# EAGLE design LED_Platine_4x4 (EAGLE 5.04)
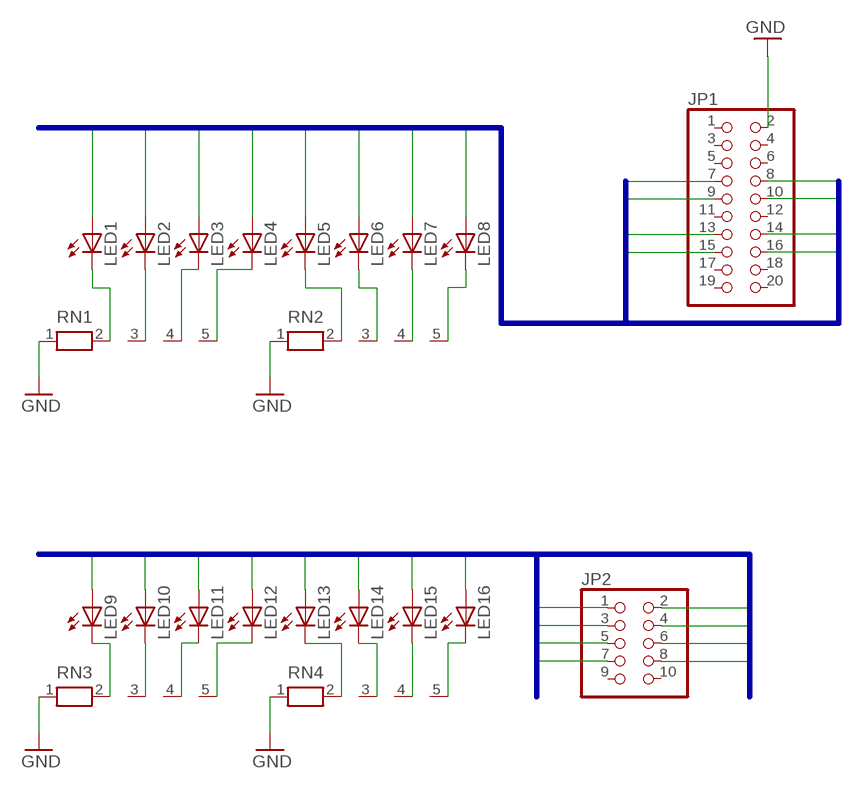
[diagram p0: schematic, sheet 1]

## Parts
JP1  PINHD-2X10  [2X10]
JP2  PINHD-2X5  [2X05]
LED1  LED3MM  [LED3MM]
LED2  LED3MM  [LED3MM]
LED3  LED3MM  [LED3MM]
LED4  LED3MM  [LED3MM]
LED5  LED3MM  [LED3MM]
LED6  LED3MM  [LED3MM]
LED7  LED3MM  [LED3MM]
LED8  LED3MM  [LED3MM]
LED9  LED3MM  [LED3MM]
LED10  LED3MM  [LED3MM]
LED11  LED3MM  [LED3MM]
LED12  LED3MM  [LED3MM]
LED13  LED3MM  [LED3MM]
LED14  LED3MM  [LED3MM]
LED15  LED3MM  [LED3MM]
LED16  LED3MM  [LED3MM]
RN1  RN04  [RN-5]
RN2  RN04  [RN-5]
RN3  RN04  [RN-5]
RN4  RN04  [RN-5]

## Nets
GND: JP1.2 RN1.1 RN2.1 RN3.1 RN4.1
IO9: JP2.1 LED9.A
IO10: JP2.2 LED10.A
IO11: JP2.3 LED11.A
IO12: JP2.4 LED12.A
IO13: JP2.5 LED13.A
IO14: JP2.6 LED14.A
IO15: JP2.7 LED15.A
IO16: JP2.8 LED16.A
N$1: LED1.K(C) RN1.2
N$2: LED2.K(C) RN1.3
N$3: LED3.K(C) RN1.4
N$4: LED4.K(C) RN1.5
N$6: LED9.K(C) RN3.2
N$7: LED10.K(C) RN3.3
N$8: LED11.K(C) RN3.4
N$10: LED12.K(C) RN3.5
N$13: LED13.K(C) RN4.2
N$14: LED5.K(C) RN2.2
N$15: LED14.K(C) RN4.3
N$16: LED6.K(C) RN2.3
N$17: LED7.K(C) RN2.4
N$18: LED8.K(C) RN2.5
N$19: LED15.K(C) RN4.4
N$20: LED16.K(C) RN4.5
P0.0: JP1.7 LED1.A
P0.1: JP1.8 LED2.A
P0.2: JP1.9 LED3.A
P0.3: JP1.10 LED4.A
P0.4: JP1.13 LED5.A
P0.5: JP1.14 LED6.A
P0.6: JP1.15 LED7.A
P0.7: JP1.16 LED8.A
Unconnected: JP1.1 JP1.3 JP1.4 JP1.5 JP1.6 JP1.11 JP1.12 JP1.17 JP1.18 JP1.19 JP1.20 JP2.9 JP2.10

## Buses
P0.[0..7]
IO[9..16]

## Library data of the parts
JP1 = pinhead:PINHD-2X10: PIN HEADER
JP2 = pinhead:PINHD-2X5: PIN HEADER
LED1-LED16 = led:LED: LED OSRAM: - CHIPLED LG R971, LG N971, LY N971, LG Q971, LY Q971, LO R971, LY R971 LH N974, LH R974 LS Q976, LO Q976, LY Q976 LO Q996 - Hyper CHIPLED LW Q18S LB Q993, LB Q99A, LB R99A - SideLED LS A670, LO A670, LY A670, LG A670, LP A670 LB A673, LV A673, LT A673, LW A673 LH A674 LY A675 LS A676, LA A676, LO A676, LY A676, LW A676 LS A679, LY A679, LG A679 - Hyper Micro SIDELED® LS Y876, LA Y876, LO Y876, LY Y876 LT Y87S - SmartLED LW L88C, LW L88S LB L89C, LB L89S, LG L890 LS L89K, LO L89K, LY L89K LS L896, LA L896, LO L896, LY L896 - TOPLED LS T670, LO T670, LY T670, LG T670, LP T670 LSG T670, LSP T670, LSY T670, LOP T670, LYG T670 LG T671, LOG T671, LSG T671 LB T673, LV T673, LT T673, LW T673 LH T674 LS T676, LA T676, LO T676, LY T676, LB T676, LH T676, LSB T676, LW T676 LB T67C, LV T67C, LT T67C, LS T67K, LO T67K, LY T67K, LW E67C LS E67B, LA E67B, LO E67B, LY E67B, LB E67C, LV E67C, LT E67C LW T67C LS T679, LY T679, LG T679 LS T770, LO T770, LY T770, LG T770, LP T770 LB T773, LV T773, LT T773, LW T773 LH T774 LS E675, LA E675, LY E675, LS T675 LS T776, LA T776, LO T776, LY T776, LB T776 LHGB T686 LT T68C, LB T68C - Hyper Mini TOPLED® LB M676 - Mini TOPLED Santana® LG M470 LS M47K, LO M47K, LY M47K Source: http://www.osram.convergy.de - LUMILED® LXK2-PW12-R00, LXK2-PW12-S00, LXK2-PW14-U00, LXK2-PW14-V00 LXK2-PM12-R00, LXK2-PM12-S00, LXK2-PM14-U00 LXK2-PE12-Q00, LXK2-PE12-R00, LXK2-PE12-S00, LXK2-PE14-T00, LXK2-PE14-U00 LXK2-PB12-K00, LXK2-PB12-L00, LXK2-PB12-M00, LXK2-PB14-N00, LXK2-PB14-P00, LXK2-PB14-Q00 LXK2-PR12-L00, LXK2-PR12-M00, LXK2-PR14-Q00, LXK2-PR14-R00 LXK2-PD12-Q00, LXK2-PD12-R00, LXK2-PD12-S00 LXK2-PH12-R00, LXK2-PH12-S00 LXK2-PL12-P00, LXK2-PL12-Q00, LXK2-PL12-R00 Source: www.luxeon.com
RN1-RN4 = resistor-net:RN04: RESISTOR NETWORK

## Board
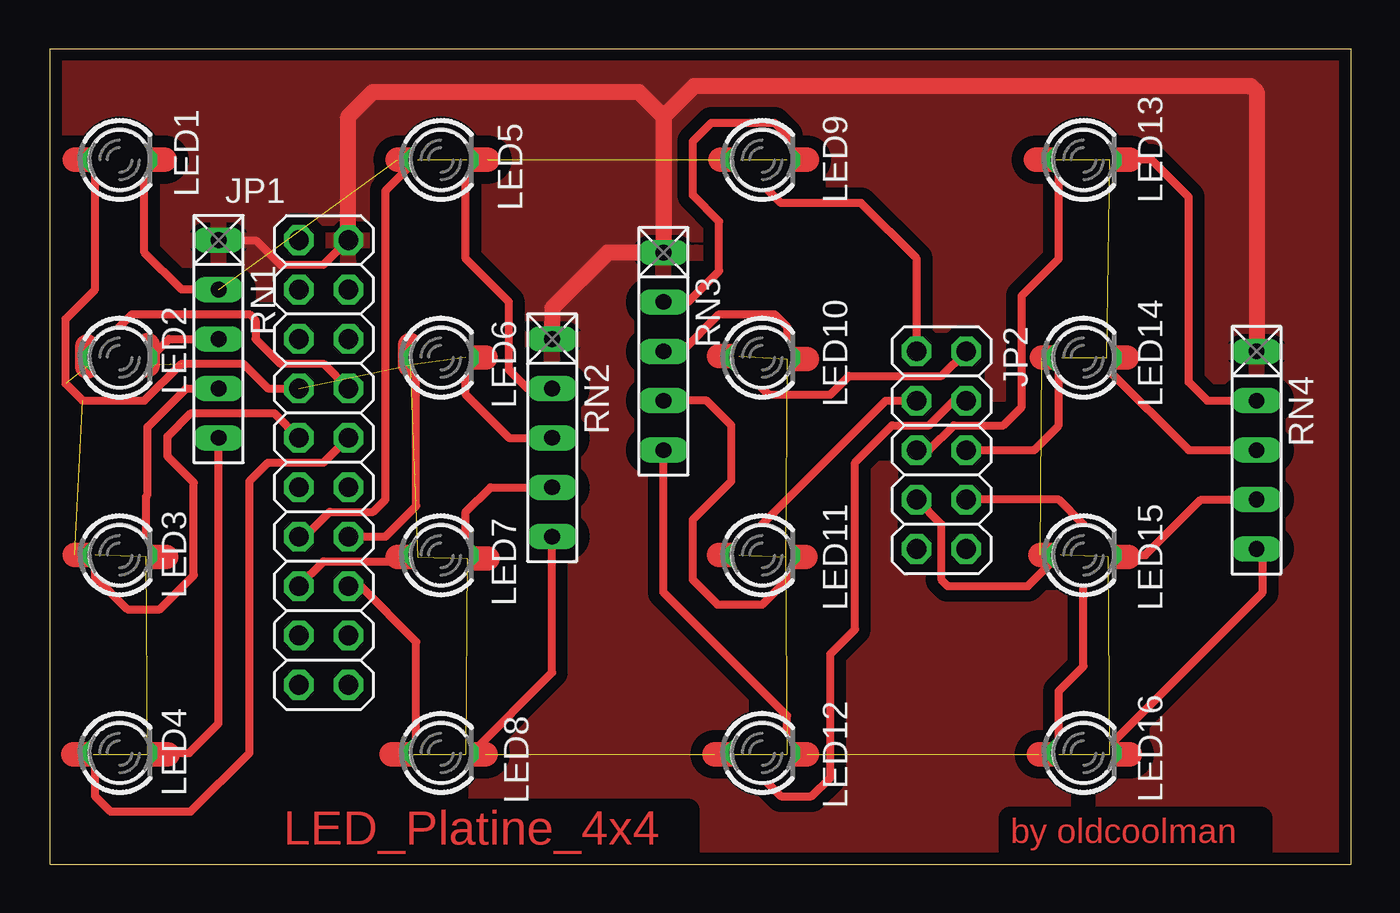
[diagram p1: board, top side]

Size 66.84 x 41.91 mm. Coordinates in mm from the lower left corner, seen from the top.
Outline: 0,0 0,41.91 66.84,41.91 66.84,0 0,0
Copper layers (1*16): Top 0.035mm / dielectric 1.5mm / Bottom 0.035mm
Design rules "default": minimum track width 10mil, minimum drill 24mil, track to track 12mil, track to pad 12mil, pad to pad 12mil, via to via 12mil, smd to smd 8mil, copper to edge 20mil, drill to drill 8mil, minimum pad ring 10mil, minimum via ring 8mil, stop-mask expansion 4mil, vias tented up to drill 0mil, thermal gap 10mil
Holes 3.2 mm at 3.58,36.2 3.58,26.03 3.58,15.87 3.58,5.71 20.09,36.2 20.09,26.03 20.09,15.87 20.09,5.71 36.59,36.2 36.59,26.03 36.59,15.87 36.59,5.71 53.1,36.2 53.1,26.03 53.1,15.87 53.1,5.71

### Footprints (pad centres in the part's own frame; a part is rotated, then mirrored left to right if it is on the bottom)
2X10 = drill 1.016 octagon: 1 -11.43,-1.27; 2 -11.43,1.27; 3 -8.89,-1.27; 4 -8.89,1.27; 5 -6.35,-1.27; 6 -6.35,1.27; 7 -3.81,-1.27; 8 -3.81,1.27; 9 -1.27,-1.27; 10 -1.27,1.27; 11 1.27,-1.27; 12 1.27,1.27; 13 3.81,-1.27; 14 3.81,1.27; 15 6.35,-1.27; 16 6.35,1.27; 17 8.89,-1.27; 18 8.89,1.27; 19 11.43,-1.27; 20 11.43,1.27
2X05 = drill 1.016 octagon: 1 -5.08,-1.27; 2 -5.08,1.27; 3 -2.54,-1.27; 4 -2.54,1.27; 5 0,-1.27; 6 0,1.27; 7 2.54,-1.27; 8 2.54,1.27; 9 5.08,-1.27; 10 5.08,1.27
LED3MM = drill 0.813 octagon: A -1.27,0; K 1.27,0
RN-5 = drill 0.813 long: 1 -5.08,0; 2 -2.54,0; 3 0,0; 4 2.54,0; 5 5.08,0

### Placement (x,y rotation side)
JP1  14.05,20.64 270 top
JP2  45.8,21.27 270 top
LED1  3.58,36.2 0 top
LED2  3.58,26.03 0 top
LED3  3.58,15.87 0 top
LED4  3.58,5.71 0 top
LED5  20.09,36.2 0 top
LED6  20.09,26.03 0 top
LED7  20.09,15.87 0 top
LED8  20.09,5.71 0 top
LED9  36.59,36.2 0 top
LED10  36.59,26.03 0 top
LED11  36.59,15.87 0 top
LED12  36.59,5.71 0 top
LED13  53.1,36.2 0 top
LED14  53.1,26.03 0 top
LED15  53.1,15.87 0 top
LED16  53.1,5.71 0 top
RN1  8.66,26.99 270 top
RN2  25.8,21.91 270 top
RN3  31.52,26.35 270 top
RN4  61.99,21.27 270 top

### Tracks (layer width: path | path; a pad name or v marks a point on that pad's centre or on a via)
GND
  Top 0.406: RN1.1 10.56,32.07 11.83,30.8 14.05,30.8 JP1.2
  Top 0.813: RN4.1 61.99,39.69 61.68,40 33.1,40 31.52,38.42 | 31.52,38.42 RN3.1 28.66,31.43 25.8,28.57 RN2.1 | JP1.2 15.32,38.42 16.59,39.69 30.25,39.69 31.52,38.42
  pour Top (isolate 0.61): -0.08,42.39 67.15,42.39 67.15,-0.48 -0.55,-0.48 -0.55,41.67
IO9
  Top 0.406: LED9.A 37.55,33.97 41.68,33.97 44.53,31.11 JP2.1
IO10
  Top 0.406: LED10.A 35.33,25.72 36.91,24.13 40.09,24.13 41.04,25.08 45.8,25.08 JP2.2
IO11
  Top 0.406: LED11.A 35.33,16.19 42.95,23.81 JP2.3
IO12
  Top 0.406: LED12.A 37.55,3.49 39.13,3.49 40.09,4.45 40.09,10.8 41.36,12.06 41.36,20.64 43.26,22.54 45.17,22.54 46.44,23.81 JP2.4
IO13
  Top 0.406: JP2.5 45.17,21.27 46.44,22.54 48.98,22.54 49.93,23.49 49.93,29.21 51.84,31.11 LED13.A
IO14
  Top 0.406: JP2.6 50.57,21.27 51.84,22.54 LED14.A
IO15
  Top 0.406: JP2.7 45.8,17.46 45.8,14.6 46.12,14.29 50.25,14.29 LED15.A
IO16
  Top 0.406: JP2.8 51.84,18.73 53.1,17.46 53.1,10.16 51.84,8.89 LED16.A
N$1  (4 unrouted)
  Top 0.406: LED1.K 4.85,31.43 6.75,29.53 RN1.2
  Top 1.27: LED1.K 5.88,36.2 | 18.89,36.2 17.86,36.2 | 21.43,36.2 22.47,36.2 | 34.45,36.2 35.48,36.2 | 38.9,36.2 37.87,36.2
N$2
  Top 0.406: LED2.K 5.16,26.03 6.12,26.99 RN1.3
N$3
  Top 0.406: RN1.4 6.99,24.45 5,22.46 5,18.97 4.92,18.89 4.92,15.95 LED3.K
N$4
  Top 0.406: RN1.5 8.66,14.6 8.65,14.6 8.66,14.6 8.66,7.22 7.15,5.72 LED4.K
N$6
  Top 0.406: LED9.K 37.87,37.46 37.23,38.1 33.98,38.1 33.02,37.15 33.02,34.37 34.37,33.02 34.37,30.48 32.79,28.89 RN3.2
N$7
  Top 0.406: RN3.3 32.47,26.35 34.37,28.26 37.23,28.26 37.87,27.62 LED10.K
N$8
  Top 0.406: LED11.K 37.87,14.6 36.59,13.33 34.29,13.33 33.02,14.6 33.02,17.7 35.01,19.69 35.01,22.54 33.74,23.81 RN3.4
N$10
  Top 0.406: RN3.5 31.52,13.97 37.87,7.62 LED12.K
N$13
  Top 0.406: LED13.K 56.6,36.2 58.5,34.29 58.5,24.77 59.46,23.81 RN4.2
N$14
  Top 0.406: LED5.K 21.36,31.11 23.58,28.89 23.58,25.4 24.53,24.45 RN2.2
N$15
  Top 0.406: LED14.K 54.38,25.4 58.5,21.27 RN4.3
N$16
  Top 0.406: LED6.K 21.36,24.13 23.58,21.91 RN2.3
N$17
  Top 0.406: LED7.K 21.36,18.1 22.62,19.37 RN2.4
N$18
  Top 0.406: LED8.K 21.67,5.72 25.8,9.84 RN2.5
N$19
  Top 0.406: LED15.K 56.28,15.87 59.14,18.73 RN4.4
N$20
  Top 0.406: LED16.K 54.38,6.03 62.31,13.97 62.31,15.87 RN4.5
P0.0  (26 unrouted)
  Top 0.406: LED1.A 2.3,29.53 0.8,28.02 0.8,24.69 1.67,23.81 4.85,23.81 6.75,25.72 9.93,25.72 11.2,24.45 JP1.7
  Top 1.27: LED1.A 1.27,36.2 | 1.27,15.87 2.3,15.87 | 4.92,15.8 5.96,15.8 | 1.19,5.64 2.23,5.64 | 5,5.64 6.04,5.64 | 17.55,5.64 18.58,5.64 | 21.36,5.64 22.39,5.64 | 21.43,15.72 22.47,15.72 | 17.86,15.8 18.89,15.8 | 34.13,5.64 35.17,5.64 | 37.87,5.64 38.9,5.64 | 34.37,15.88 35.4,15.88 | 37.79,15.8 38.82,15.8 | 34.37,26.11 35.4,26.11 | 37.87,25.96 38.9,25.96 | 50.96,26.04 51.99,26.04 | 54.29,26.04 55.33,26.04 | 54.38,15.8 55.41,15.8 | 50.88,15.88 51.91,15.88 | 50.8,5.64 51.84,5.64 | 54.45,5.64 55.49,5.64 | 54.45,36.2 55.49,36.2 | 50.64,36.2 51.68,36.2 | 21.36,26.03 22.39,26.03 | 18.5,25.64 18.5,26.67 | 1.91,25.56 1.91,26.59 | 5,25.64 5,26.67
P0.1
  Top 0.406: LED2.A 2.3,26.35 4.21,28.26 10.24,28.26 10.56,27.94 10.56,26.99 11.83,25.72 14.05,25.72 JP1.8
P0.2
  Top 0.406: LED3.A 2.3,14.76 3.97,13.1 5.64,13.1 7.39,14.84 7.39,19.61 6.04,20.96 6.04,21.99 7.23,23.18 11.51,23.18 JP1.9
P0.3
  Top 0.406: JP1.10 14.05,20.64 11.2,20.64 10.24,19.69 10.24,5.72 7.23,2.7 3.1,2.7 2.3,3.49 LED4.A
P0.4
  Top 0.406: JP1.13 13.1,16.83 14.37,18.1 16.59,18.1 17.23,18.73 17.23,34.61 LED5.A
P0.5
  Top 0.406: JP1.14 17.23,16.83 18.82,18.42 LED6.A
P0.6
  Top 0.406: JP1.15 14.05,15.56 18.5,15.56 LED7.A
P0.7
  Top 0.406: JP1.16 15.96,14.29 18.82,11.43 LED8.A

### Text on the board
Top: LED_Platine_4x4 | by oldcoolman